# Altium schematic sheet EEPROM.SchDoc
size A
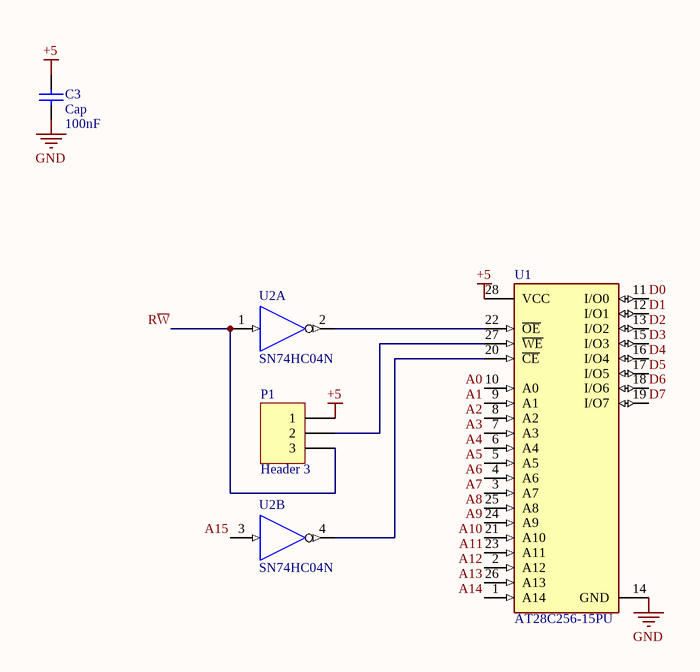
[diagram p0: EEPROM.SchDoc]

## Parts
C3  Cap  value 100nF  [Ceramic Capacitor]
P1  Header 3  [HDR1X3]
U1  AT28C256-15PU  [FP-28P6-MFG]
U2  SN74HC04N  [N0014A]  (parts A,B of 7)

## Nets
+5: C3.1 P1.1 U1.28(VCC)
GND: C3.2 U1.14(GND)
A0: U1.10(A0)
A1: U1.9(A1)
A2: U1.8(A2)
A3: U1.7(A3)
A4: U1.6(A4)
A5: U1.5(A5)
A6: U1.4(A6)
A7: U1.3(A7)
A8: U1.25(A8)
A9: U1.24(A9)
A10: U1.21(A10)
A11: U1.23(A11)
A12: U1.2(A12)
A13: U1.26(A13)
A14: U1.1(A14)
A15: U2.3(2A)
D0: U1.11(I/O0)
D1: U1.12(I/O1)
D2: U1.13(I/O2)
D3: U1.15(I/O3)
D4: U1.16(I/O4)
D5: U1.17(I/O5)
D6: U1.18(I/O6)
D7: U1.19(I/O7)
R~{W}: P1.3 U2.1(1A)
NetP1_2: P1.2 U1.27(~{WE})
NetU1_20: U1.20(~{CE}) U2.4(~{2Y})
NetU1_22: U1.22(~{OE}) U2.2(~{1Y})

## Library data of the parts
C3 = Cap: Capacitor; Published: 8-Jun-2000; LatestRevisionDate: 17-Jul-2002; LatestRevisionNote: Re-released for DXP Platform.; PackageReference: RAD-0.3; Publisher: Altium Limited; PackageDescription: Radial Cap, Thru-Hole; 2 Leads; 0.3 in Pin Spacing
P1 = Header 3: Header, 3-Pin; LatestRevisionDate: 17-Jul-2002; LatestRevisionNote: Re-released for DXP Platform.; Publisher: Altium Limited
U1 = CMP-06313-000003-1: IC EEPROM 256K PARALLEL 28DIP; Manufacturer: Microchip; Max Supply Voltage: 5.5V; Nominal Supply Current: 50mA; Memory Size: 256Kbits; Access Time: 150ns; Min Supply Voltage: 4.5V; Standoff Height: 0.381mm; Digikey Description: IC EEPROM 256K PARALLEL 28DIP; Device Class L3: EEPROM; Temperature: -40°C to +85°C; RoHS: TRUE; Device Class L1: Integrated Circuits (ICs); ComponentLink2Description: Datasheet; Memory Type: EEPROM; Package: 28P6; Interface: Parallel; Manufacturer Part Number: AT28C256-15PU; Device Class L2: Memory; ComponentLink2URL: http://ww1.microchip.com/downloads/en/DeviceDoc/doc0006.pdf; Temperature Range Low: -40°C; Category: IC; Lead Free: Yes; Automotive: No; Ipc Land Pattern Name: DIP1556W46P254L3734H483Q28; Height: 4.826mm; Octopart: https://octopart.com/at28c256-15pu-microchip-77758240; Temperature Range High: +85°C
U2 = CMP-1615-00892-2: Hex Inverters, N0014A, TUBE; Manufacturer: Texas Instruments; VCC(Min)(V): 2; Bits(#): 6; Technology Family: HC; tpd @ Nom Voltage(Max)(ns): 20; Output Drive (IOL/IOH)(Max)(mA): -4/4; Rating: Catalog; Voltage(Nom)(V): 5; Schmitt Trigger: No; ICC @ Nom Voltage(Max)(mA): 0.02; Input Type: CMOS; Code_JEDEC: MS-001; PackageReference: N0014A; DatasheetVersion: SCLS078F; Output Type: CMOS; VCC(Max)(V): 6; Operating Temperature Range(C): -40 to 85; Generic Part Number: SN74HC04; F @ Nom Voltage(Max)(Mhz): 20